# Altium schematic sheet Sheet1.SchDoc (part 1 of 2)
size A1; SheetNumber: 1; SheetTotal: 1
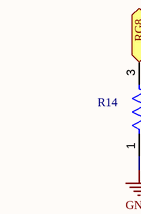
[diagram p0: Sheet1.SchDoc, top left]
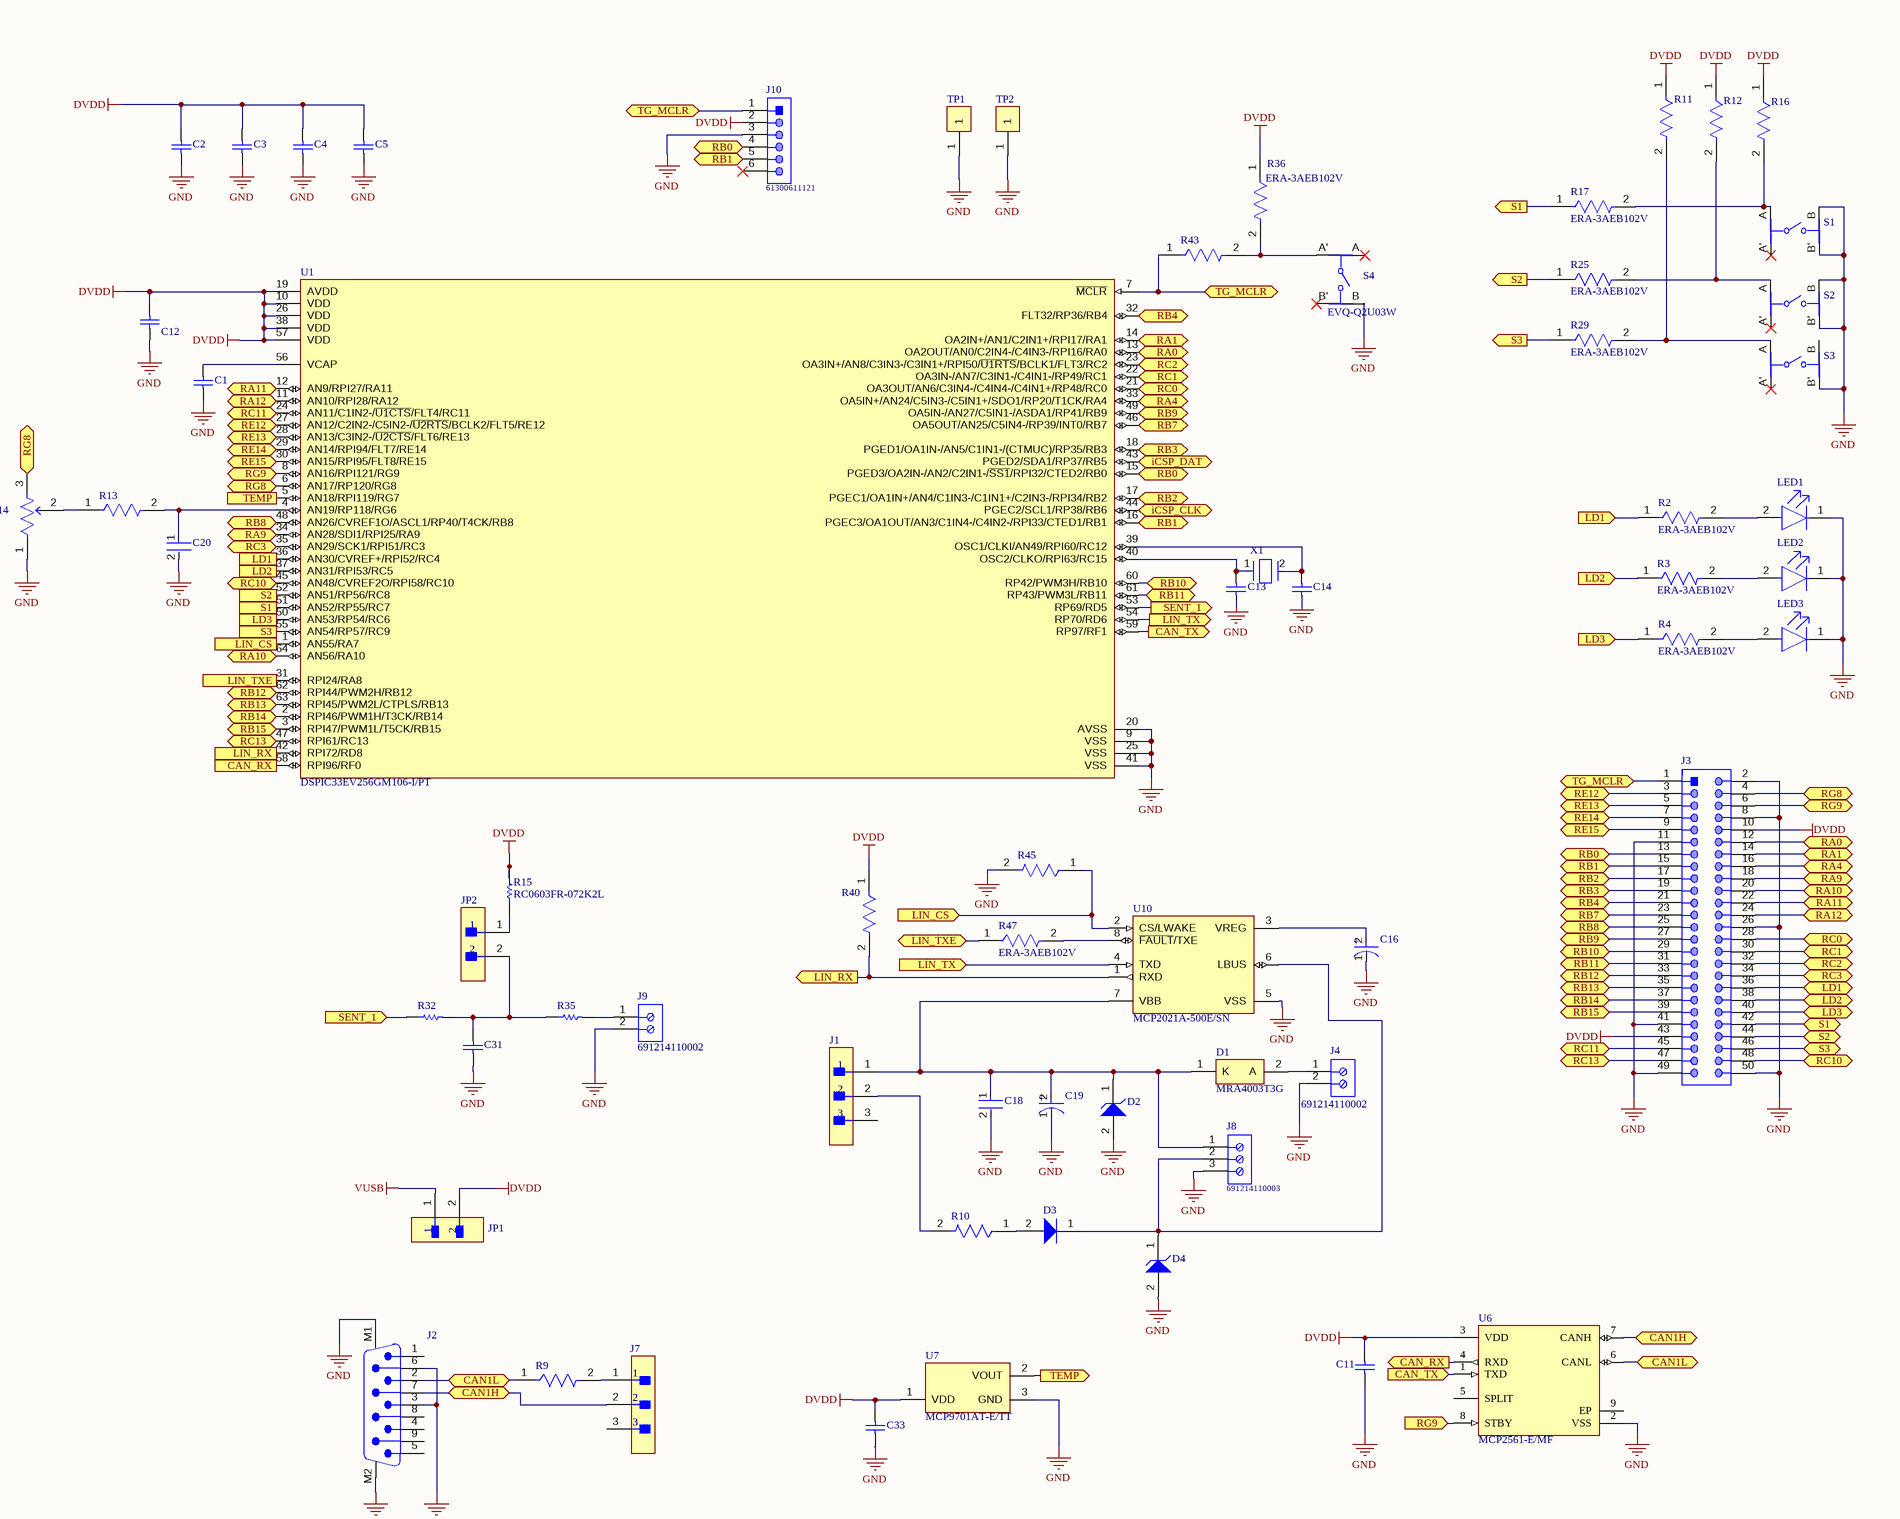
[diagram p1: Sheet1.SchDoc, top right]
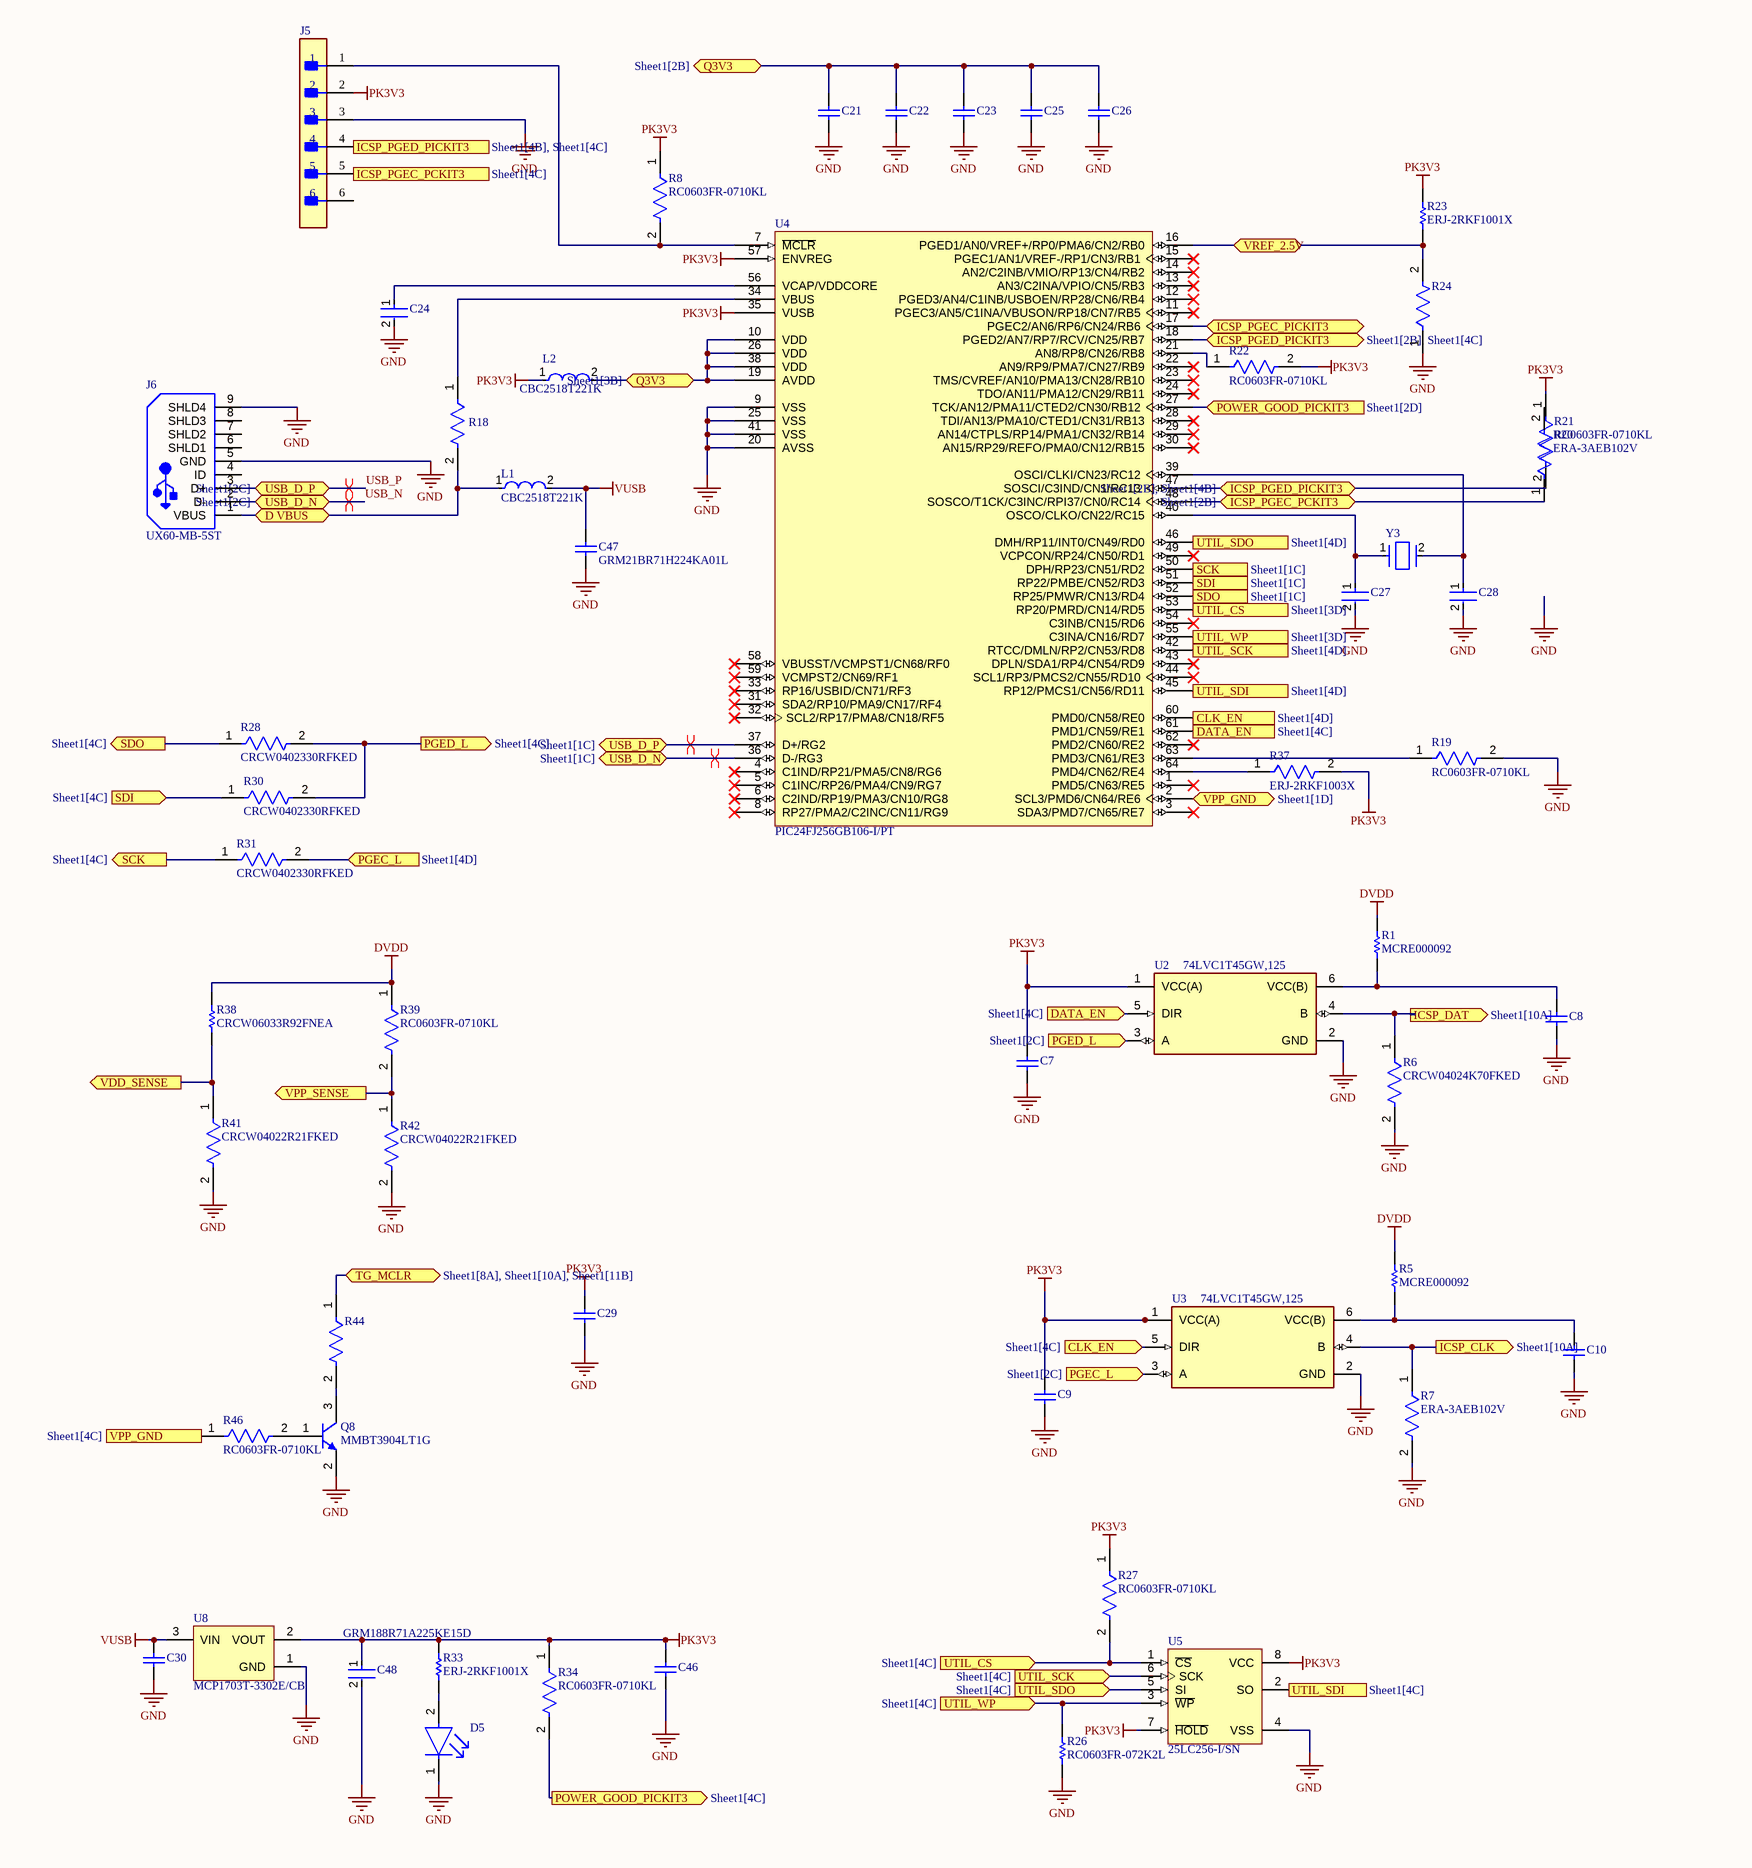
[diagram p2: Sheet1.SchDoc, bottom left]

## Parts
C1  CAP 10uF 25V 1206(3216)  [CAPC1206(3216)190_N]  (value not drawn)
C2  (no value)  [CAPC1608X90X35ML10T15]
C3  (no value)  [CAPC1608X90X35ML10T15]
C4  (no value)  [CAPC1608X90X35ML10T15]
C5  (no value)  [CAPC1608X90X35ML10T15]
C7  (no value)  [CAPC1608X90X35ML10T15]
C8  (no value)  [CAPC1608X90X35ML10T15]
C9  (no value)  [CAPC1608X90X35ML10T15]
C10  (no value)  [CAPC1608X90X35ML10T15]
C11  VJ0603Y104JXACW1BC  [CAPC1608X95X40LL15T15]  (value not drawn)
C12  CAP 220nF 50V 0805(2012)  [CAPC0805(2012)100_M]  (value not drawn)
C13  CC0603JRNPO9BN270  [CAPC1608X90X40LL10T20]  (value not drawn)
C14  CC0603JRNPO9BN270  [CAPC1608X90X40LL10T20]  (value not drawn)
C16  EEE-FK1H100P  [FP-FKD-MFG]  (value not drawn)
C18  (no value)  [FP-C0603C-CF-IPC_C]
C19  EEE-FK1H100P  [FP-FKD-MFG]  (value not drawn)
C20  CC0805KRX7R9BB222  [FP-CC0805-0_85-MFG]  (value not drawn)
C21  (no value)  [CAPC1608X90X35ML10T15]
C22  (no value)  [CAPC1608X90X35ML10T15]
C23  (no value)  [CAPC1608X90X35ML10T15]
C24  (no value)  [FP-GRM21B-0_15-MFG]
C25  (no value)  [CAPC1608X90X35ML10T15]
C26  (no value)  [CAPC1608X90X35ML10T15]
C27  (no value)  [FP-C0402-BB-MFG]
C28  (no value)  [FP-C0402-BB-MFG]
C29  (no value)  [CAPC1608X90X35ML10T15]
C30  (no value)  [CAPC1608X90X35ML10T15]
C31  GRM188R71H222KA01D  [CAPC1608X90X35NL10T15]  (value not drawn)
C33  VJ0603Y104JXACW1BC  [CAPC1608X95X40LL15T15]  (value not drawn)
C46  (no value)  [CAPC1608X90X35ML10T15]
C47  GRM21BR71H224KA01L  [CAPC2013X135X45NL10T25]
C48  GRM188R71A225KE15D  [FP-GRM188-0_1-e0_2_0_5-MFG]
D1  MRA4003T3G  [ONSC-SMA-2-403D-02_V]
D2  MMSZ43T1G  [ONSC-SOD-123-2-425-04_V]  (value not drawn)
D3  BAS21HT1G  [ONSC-SOD-323-2-477-02_V]  (value not drawn)
D4  1SMB5935BT3G  [ONSC-SMB-2-403A-03_H_V]  (value not drawn)
D5  (no value)  [FP-LTST-C190GKT-MFG]
J1  87224-3  [FP-87224-3-MFG]  (value not drawn)
J2  618009231421  [618009231421]  (value not drawn)
J3  61205021621  [61205021621]  (value not drawn)
J4  691214110002  [691214110002]
J5  (no value)  [FP-TMM-106-01-T-S-RA-MFG]
J6  UX60-MB-5ST  [HIRO-UX60-MB-5ST_V]
J7  87224-3  [FP-87224-3-MFG]  (value not drawn)
J8  691214110003  [691214110003]
J9  691214110002  [691214110002]
J10  61300611121  [61300611121]
JP1  M20-9990246  [FP-M20-9990246-MFG]  (value not drawn)
JP2  TSW-102-07-F-S  [FP-TSW-102-07-F-S-MFG]  (value not drawn)
L1  CBC2518T221K  [FP-CB2518-IPC_B]
L2  CBC2518T221K  [FP-CB2518-IPC_B]
LED1  LTST-C230KRKT  [FP-LTST-C230KRKT-MFG]  (value not drawn)
LED2  LTST-C230KRKT  [FP-LTST-C230KRKT-MFG]  (value not drawn)
LED3  LTST-C230KRKT  [FP-LTST-C230KRKT-MFG]  (value not drawn)
Q8  MMBT3904LT1G  [ONSC-SOT-23-3-318-08_V]
R1  MCRE000092  [RESC0603X26X15LL03T05]
R2  ERA-3AEB102V  [FP-ERA3A-IPC_B]
R3  ERA-3AEB102V  [FP-ERA3A-IPC_B]
R4  ERA-3AEB102V  [FP-ERA3A-IPC_B]
R5  MCRE000092  [RESC0603X26X15LL03T05]
R6  CRCW04024K70FKED  [FP-CRCW0402-e3-IPC_C]
R7  ERA-3AEB102V  [FP-ERA3A-IPC_B]
R8  RC0603FR-0710KL  [FP-RC0603-0_55-IPC_C]
R9  (no value)  [FP-CRCW0603-e3-IPC_C]
R10  (no value)  [FP-RC0603-0_55-IPC_C]
R11  (no value)  [FP-RC0603-0_55-IPC_C]
R12  (no value)  [FP-RC0603-0_55-IPC_C]
R13  (no value)  [FP-MCT0603-IPC_C]
R14  3296W-1-253LF  [FP-3296W-MFG]  (value not drawn)
R15  RC0603FR-072K2L  [RESC1608X55X25LL10T15]
R16  (no value)  [FP-RC0603-0_55-IPC_C]
R17  ERA-3AEB102V  [FP-ERA3A-IPC_B]
R18  (no value)  [FP-ERJ2RK-IPC_C]
R19  RC0603FR-0710KL  [FP-RC0603-0_55-IPC_C]
R20  ERA-3AEB102V  [FP-ERA3A-IPC_B]
R21  RC0603FR-0710KL  [FP-RC0603-0_55-IPC_C]
R22  RC0603FR-0710KL  [FP-RC0603-0_55-IPC_C]
R23  ERJ-2RKF1001X  [RESC1005X40X25NL05T05]
R24  (no value)  [FP-CRCW0603-e3-IPC_C]
R25  ERA-3AEB102V  [FP-ERA3A-IPC_B]
R26  RC0603FR-072K2L  [RESC1608X55X25LL10T15]
R27  RC0603FR-0710KL  [FP-RC0603-0_55-IPC_C]
R28  CRCW0402330RFKED  [FP-CRCW0402-e3-IPC_C]
R29  ERA-3AEB102V  [FP-ERA3A-IPC_B]
R30  CRCW0402330RFKED  [FP-CRCW0402-e3-IPC_C]
R31  CRCW0402330RFKED  [FP-CRCW0402-e3-IPC_C]
R32  RC0603FR-0747RL  [RESC1608X55X25ML10T15]  (value not drawn)
R33  ERJ-2RKF1001X  [RESC1005X40X25NL05T05]
R34  RC0603FR-0710KL  [FP-RC0603-0_55-IPC_C]
R35  RC0603FR-0747RL  [RESC1608X55X25ML10T15]  (value not drawn)
R36  ERA-3AEB102V  [FP-ERA3A-IPC_B]
R37  ERJ-2RKF1003X  [FP-ERJ2RK-IPC_C]
R38  CRCW06033R92FNEA  [RESC1609X50X30LL10T20]
R39  RC0603FR-0710KL  [FP-RC0603-0_55-IPC_C]
R40  (no value)  [FP-RC0603-0_55-IPC_C]
R41  CRCW04022R21FKED  [FP-CRCW0402-e3-IPC_C]
R42  CRCW04022R21FKED  [FP-CRCW0402-e3-IPC_C]
R43  (no value)  [FP-MCT0603-IPC_C]
R44  (no value)  [FP-MCT0603-IPC_C]
R45  (no value)  [FP-RC0603-0_55-IPC_C]
R46  RC0603FR-0710KL  [FP-RC0603-0_55-IPC_C]
R47  ERA-3AEB102V  [FP-ERA3A-IPC_B]
S1  (no value)  [FP-EVQQ2-MFG]
S2  (no value)  [FP-EVQQ2-MFG]
S3  (no value)  [FP-EVQQ2-MFG]
S4  EVQ-Q2U03W  [FP-EVQQ2-MFG]
TP1  5001  [FP-5001-MFG]  (value not drawn)
TP2  5001  [FP-5001-MFG]  (value not drawn)
U1  DSPIC33EV256GM106-I/PT  [FP-C04-085-IPC_B]
U2  74LVC1T45GW,125  [FP-SOT363-IPC_C]
U3  74LVC1T45GW,125  [FP-SOT363-IPC_C]
U4  PIC24FJ256GB106-I/PT  [TQFP-PT64_L]
U5  25LC256-I/SN  [SOIC-SN8_L]
U6  MCP2561-E/MF  [FP-C04-062-MFG]
U7  MCP9701AT-E/TT  [SOT-23-TT3_M]
U8  MCP1703T-3302E/CB  [SOT-23A-CB3_L]
U10  MCP2021A-500E/SN  [MCHP-SOIC-SN8_N]
X1  ABLS2-8.000MHZ-D4Y-T  [FP-ABLS2-MFG]  (value not drawn)
Y3  (no value)  [FP-ABM7-MFG]

## Ports
CAN1H (bidir, see Sheet1[8C]), CAN1H (bidir, see Sheet1[11C]), CAN1L (bidir, see Sheet1[8C]), CAN1L (bidir, see Sheet1[11C]), CAN_RX (in, see Sheet1[11C]), CAN_RX (out, see Sheet1[7B]), CAN_TX (in, see Sheet1[10B]), CAN_TX (out, see Sheet1[11C]), CLK_EN (in, see Sheet1[4C]), CLK_EN (out, see Sheet1[4D]), D VBUS (bidir), DATA_EN (in, see Sheet1[4C]), DATA_EN (out, see Sheet1[4C]), iCSP_CLK (bidir, see Sheet1[5D]), ICSP_CLK (out, see Sheet1[10A]), iCSP_DAT (bidir, see Sheet1[5C]), ICSP_DAT (out, see Sheet1[10A]), ICSP_PGEC_PCKIT3 (bidir, see Sheet1[2B]), ICSP_PGEC_PCKIT3 (out, see Sheet1[4C]), ICSP_PGEC_PICKIT3 (bidir), ICSP_PGED_PICKIT3 (bidir, see Sheet1[2B], Sheet1[4B]), ICSP_PGED_PICKIT3 (bidir, see Sheet1[2B], Sheet1[4C]), ICSP_PGED_PICKIT3 (out, see Sheet1[4B], Sheet1[4C]), LD1 (bidir, see Sheet1[7A], Sheet1[11A]), LD1 (in, see Sheet1[7A], Sheet1[12B]), LD1 (out, see Sheet1[11A], Sheet1[12B]), LD2 (bidir, see Sheet1[7A], Sheet1[11A]), LD2 (in, see Sheet1[7A], Sheet1[12B]), LD2 (out, see Sheet1[11A], Sheet1[12B]), LD3 (bidir, see Sheet1[7A], Sheet1[11B]), LD3 (in, see Sheet1[7A], Sheet1[12B]), LD3 (out, see Sheet1[11B], Sheet1[12B]), LIN_CS (in, see Sheet1[7B]), LIN_CS (out, see Sheet1[9B]), LIN_RX (in, see Sheet1[9B]), LIN_RX (out), LIN_TX (in, see Sheet1[10A]), LIN_TX (out, see Sheet1[9B]), LIN_TXE (bidir, see Sheet1[7B]), LIN_TXE (out, see Sheet1[9B]), PGEC_L (in, see Sheet1[2C]), PGEC_L (in, see Sheet1[4D]), PGED_L (in, see Sheet1[2C]), PGED_L (out, see Sheet1[4C]), POWER_GOOD_PICKIT3 (in, see Sheet1[2D]), POWER_GOOD_PICKIT3 (out, see Sheet1[4C]), Q3V3 (bidir, see Sheet1[2B]), Q3V3 (bidir, see Sheet1[3B]), RA0 (bidir, see Sheet1[10A]), RA0 (bidir, see Sheet1[12B]), RA1 (bidir, see Sheet1[10A]), RA1 (bidir, see Sheet1[12B]), RA4 (bidir, see Sheet1[10A]), RA4 (bidir, see Sheet1[12B]), RA9 (bidir, see Sheet1[7A]), RA9 (bidir, see Sheet1[12B]), RA10 (bidir, see Sheet1[7B]), RA10 (bidir, see Sheet1[12B]), RA11 (bidir, see Sheet1[7A]), RA11 (bidir, see Sheet1[12B]), RA12 (bidir, see Sheet1[7A]), RA12 (bidir, see Sheet1[12B]), RB0 (bidir, see Sheet1[8A], Sheet1[10A]), RB0 (bidir, see Sheet1[8A], Sheet1[11B]), RB0 (bidir, see Sheet1[10A], Sheet1[11B]), RB1 (bidir, see Sheet1[8A], Sheet1[10A]), RB1 (bidir, see Sheet1[8A], Sheet1[11B]), RB1 (bidir, see Sheet1[10A], Sheet1[11B]), RB2 (bidir, see Sheet1[10A]), RB2 (bidir, see Sheet1[11B]), RB3 (bidir, see Sheet1[10A]), RB3 (bidir, see Sheet1[11B]), RB4 (bidir, see Sheet1[10A]), RB4 (bidir, see Sheet1[11B]), RB7 (bidir, see Sheet1[10A]), RB7 (bidir, see Sheet1[11B]), RB8 (bidir, see Sheet1[7A]), RB8 (bidir, see Sheet1[11B]), RB9 (bidir, see Sheet1[10A]), RB9 (bidir, see Sheet1[11B]), RB10 (bidir, see Sheet1[10A]), RB10 (bidir, see Sheet1[11B]), RB11 (bidir, see Sheet1[10A]), RB11 (bidir, see Sheet1[11B]), RB12 (bidir, see Sheet1[7B]), RB12 (bidir, see Sheet1[11B]), RB13 (bidir, see Sheet1[7B]), RB13 (bidir, see Sheet1[11B]), RB14 (bidir, see Sheet1[7B]), RB14 (bidir, see Sheet1[11B]), RB15 (bidir, see Sheet1[7B]), RB15 (bidir, see Sheet1[11B]), RC0 (bidir, see Sheet1[10A]), RC0 (bidir, see Sheet1[12B]), RC1 (bidir, see Sheet1[10A]), RC1 (bidir, see Sheet1[12B]), RC2 (bidir, see Sheet1[10A]), RC2 (bidir, see Sheet1[12B]), RC3 (bidir, see Sheet1[7A]), RC3 (bidir, see Sheet1[12B]), RC10 (bidir, see Sheet1[7A]), RC10 (bidir, see Sheet1[12B]), RC11 (bidir, see Sheet1[7A]), RC11 (bidir, see Sheet1[11B]), RC13 (bidir, see Sheet1[7B]), RC13 (bidir, see Sheet1[11B]), RE12 (bidir, see Sheet1[7A]), RE12 (bidir, see Sheet1[11B]), RE13 (bidir, see Sheet1[7A]), RE13 (bidir, see Sheet1[11B]), RE14 (bidir, see Sheet1[7A]), RE14 (bidir, see Sheet1[11B]), RE15 (bidir, see Sheet1[7A]), RE15 (bidir, see Sheet1[11B]), RG8 (bidir, see Sheet1[6A], Sheet1[7A]), RG8 (bidir, see Sheet1[6A], Sheet1[12B]), RG8 (bidir, see Sheet1[7A], Sheet1[12B]), RG9 (bidir, see Sheet1[7A], Sheet1[11C]), RG9 (bidir, see Sheet1[11C], Sheet1[12B]), RG9 (in, see Sheet1[7A], Sheet1[12B]), S1 (bidir, see Sheet1[7A], Sheet1[11A]), S1 (in, see Sheet1[11A], Sheet1[12B]), S1 (out, see Sheet1[7A], Sheet1[12B]), S2 (bidir, see Sheet1[7A], Sheet1[11A]), S2 (in, see Sheet1[11A], Sheet1[12B]), S2 (out, see Sheet1[7A], Sheet1[12B]), S3 (bidir, see Sheet1[7B], Sheet1[11A]), S3 (in, see Sheet1[11A], Sheet1[12B]), S3 (out, see Sheet1[7B], Sheet1[12B]), SCK (out, see Sheet1[1C]), SCK (out, see Sheet1[4C]), SDI (in, see Sheet1[1C]), SDI (in, see Sheet1[4C]), SDO (out, see Sheet1[1C]), SDO (out, see Sheet1[4C]), SENT_1 (in, see Sheet1[10A]), SENT_1 (out, see Sheet1[7B]), TEMP (in, see Sheet1[9C]), TEMP (out, see Sheet1[7A]), TG_MCLR (bidir, see Sheet1[2D], Sheet1[8A], Sheet1[10A]), TG_MCLR (bidir, see Sheet1[2D], Sheet1[8A], Sheet1[11B]), TG_MCLR (bidir, see Sheet1[2D], Sheet1[10A], Sheet1[11B]), TG_MCLR (bidir, see Sheet1[8A], Sheet1[10A], Sheet1[11B]), USB_D_N (bidir, see Sheet1[1C]), USB_D_N (bidir, see Sheet1[2C]), USB_D_P (bidir, see Sheet1[1C]), USB_D_P (bidir, see Sheet1[2C]), UTIL_CS (in, see Sheet1[4C]), UTIL_CS (out, see Sheet1[3D]), UTIL_SCK (in, see Sheet1[4C]), UTIL_SCK (out, see Sheet1[4D]), UTIL_SDI (in, see Sheet1[4D]), UTIL_SDI (out, see Sheet1[4C]), UTIL_SDO (in, see Sheet1[4C]), UTIL_SDO (out, see Sheet1[4D]), UTIL_WP (in, see Sheet1[4C]), UTIL_WP (out, see Sheet1[3D]), VDD_SENSE (out), VPP_GND (bidir, see Sheet1[1D]), VPP_GND (in, see Sheet1[4C]), VPP_SENSE (out), VREF_2.5V (bidir)

## Nets
DVDD: C2.1 C3.1 C4.1 C5.1 C11.2 C12.2 C33.2 J3.10(DVDD) J3.43(DVDD) J10.2 JP1.2 R1.2 R5.2 R11.1 R12.1 R15.2 R16.1 R36.1 R38.2 R39.1 R40.1 U1.10(VDD) U1.19(AVDD) U1.26(VDD) U1.38(VDD) U1.57(VDD) U6.3(VDD) U7.1(VDD)
GND: C1.1 C2.2 C3.2 C4.2 C5.2 C7.2 C8.2 C9.2 C10.2 C11.1 C12.1 C13.1 C14.1 C16.1(C) C18.2 C19.1(C) C20.2 C21.2 C22.2 C23.2 C24.2 C25.2 C26.2 C27.2 C28.2 C29.2 C30.2 C31.1 C33.1 C46.2 C47.2 C48.2 D2.2(A) D4.2(A) D5.1(C) J2.3 J2.6 J2.M1 J2.M2 J3.2(GND) J3.8(GND) J3.11(GND) J3.26(GND) J3.41(GND) J3.49(GND) J3.50(GND) J4.2 J5.3 J6.5(GND) J6.9(SHLD4) J8.3 J9.2 J10.3 LED1.1(C) LED2.1(C) LED3.1(C) Q8.2(E) R6.2 R7.2 R14.1(CCW) R19.2 R24.1 R26.1 R41.2 R42.2 R45.2 S1.B S1.B' S2.B S2.B' S3.B' S4.B TP1.1 TP2.1 U1.9(VSS) U1.20(AVSS) U1.25(VSS) U1.41(VSS) U2.2(GND) U3.2(GND) U4.9(VSS) U4.20(AVSS) U4.25(VSS) U4.41(VSS) U5.4(VSS) U6.2(VSS) U7.3(GND) U8.1(GND) U10.5(VSS)
PK3V3: C7.1 C9.1 C29.1 C46.1 C48.1 J5.2 L2.1 R8.1 R21.1 R22.2 R23.1 R27.1 R33.1 R34.1 R37.2 U2.1(VCC(A)) U3.1(VCC(A)) U4.35(VUSB) U4.57(ENVREG) U5.7(~{HOLD}) U5.8(VCC) U8.2(VOUT)
VUSB: C30.1 C47.1 JP1.1 L1.2 U8.3(VIN)
CAN1H: J2.7 J7.2 U6.7(CANH) ; port CAN1H
CAN1L: J2.2 R9.1 U6.6(CANL) ; port CAN1L
CAN_RX: U1.58(RPI96/RF0) U6.4(RXD) ; port CAN_RX
CAN_TX: U1.59(RP97/RF1) U6.1(TXD) ; port CAN_TX
CLK_EN: U3.5(DIR) U4.60(PMD0/CN58/RE0) ; port CLK_EN
D VBUS: J6.1(VBUS) L1.1 R18.2 ; port D VBUS
DATA_EN: U2.5(DIR) U4.61(PMD1/CN59/RE1) ; port DATA_EN
ICSP_CLK: R7.1 U1.44(PGEC2/SCL1/RP38/RB6) U3.4(B) ; port ICSP_CLK, port iCSP_CLK
ICSP_DAT: R6.1 U1.43(PGED2/SDA1/RP37/RB5) U2.4(B) ; port ICSP_DAT, port iCSP_DAT
ICSP_PGEC_PCKIT3: J5.5 R20.1 U4.48(SOSCO/T1CK/C3INC/RPI37/CN0/RC14) ; port ICSP_PGEC_PCKIT3
ICSP_PGEC_PICKIT3: U4.17(PGEC2/AN6/RP6/CN24/RB6) ; port ICSP_PGEC_PICKIT3
ICSP_PGED_PICKIT3: J5.4 R21.2 U4.18(PGED2/AN7/RP7/RCV/CN25/RB7) U4.47(SOSCI/C3IND/CN1/RC13) ; port ICSP_PGED_PICKIT3
LD1: J3.36(RC4) R2.1 U1.36(AN30/CVREF+/RPI52/RC4) ; port LD1
LD2: J3.38(RC5) R3.1 U1.37(AN31/RPI53/RC5) ; port LD2
LD3: J3.40(RC6) R4.1 U1.50(AN53/RP54/RC6) ; port LD3
LIN_CS: R45.1 U1.1(AN55/RA7) U10.2(CS/LWAKE) ; port LIN_CS
LIN_RX: R40.2 U1.42(RPI72/RD8) U10.1(RXD) ; port LIN_RX
LIN_TX: U1.54(RP70/RD6) U10.4(TXD) ; port LIN_TX
LIN_TXE: R47.1 U1.31(RPI24/RA8) ; port LIN_TXE
PGEC_L: R31.2 U3.3(A) ; port PGEC_L
PGED_L: R28.2 R30.2 U2.3(A) ; port PGED_L
POWER_GOOD_PICKIT3: R34.2 U4.27(TCK/AN12/PMA11/CTED2/CN30/RB12) ; port POWER_GOOD_PICKIT3
Q3V3: C21.1 C22.1 C23.1 C25.1 C26.1 L2.2 U4.10(VDD) U4.19(AVDD) U4.26(VDD) U4.38(VDD) ; port Q3V3
RA0: J3.12(RA0) U1.13(OA2OUT/AN0/C2IN4-/C4IN3-/RPI16/RA0) ; port RA0
RA1: J3.14(RA1) U1.14(OA2IN+/AN1/C2IN1+/RPI17/RA1) ; port RA1
RA4: J3.16(RA4) U1.33(OA5IN+/AN24/C5IN3-/C5IN1+/SDO1/RP20/T1CK/RA4) ; port RA4
RA9: J3.18(RA9) U1.34(AN28/SDI1/RPI25/RA9) ; port RA9
RA10: J3.20(RA10) U1.64(AN56/RA10) ; port RA10
RA11: J3.22(RA11) U1.12(AN9/RPI27/RA11) ; port RA11
RA12: J3.24(RA12) U1.11(AN10/RPI28/RA12) ; port RA12
RB0: J3.13(RB0) J10.4 U1.15(PGED3/OA2IN-/AN2/C2IN1-/~{SS1}/RPI32/CTED2/RB0) ; port RB0
RB1: J3.15(RB1) J10.5 U1.16(PGEC3/OA1OUT/AN3/C1IN4-/C4IN2-/RPI33/CTED1/RB1) ; port RB1
RB2: J3.17(RB2) U1.17(PGEC1/OA1IN+/AN4/C1IN3-/C1IN1+/C2IN3-/RPI34/RB2) ; port RB2
RB3: J3.19(RB3) U1.18(PGED1/OA1IN-/AN5/C1IN1-/(CTMUC)/RP35/RB3) ; port RB3
RB4: J3.21(RB4) U1.32(FLT32/RP36/RB4) ; port RB4
RB7: J3.23(RB7) U1.46(OA5OUT/AN25/C5IN4-/RP39/INT0/RB7) ; port RB7
RB8: J3.25(RB8) U1.48(AN26/CVREF1O/ASCL1/RP40/T4CK/RB8) ; port RB8
RB9: J3.27(RB9) U1.49(OA5IN-/AN27/C5IN1-/ASDA1/RP41/RB9) ; port RB9
RB10: J3.29(RB10) U1.60(RP42/PWM3H/RB10) ; port RB10
RB11: J3.31(RB11) U1.61(RP43/PWM3L/RB11) ; port RB11
RB12: J3.33(RB12) U1.62(RPI44/PWM2H/RB12) ; port RB12
RB13: J3.35(RB13) U1.63(RPI45/PWM2L/CTPLS/RB13) ; port RB13
RB14: J3.37(RB14) U1.2(RPI46/PWM1H/T3CK/RB14) ; port RB14
RB15: J3.39(RB15) U1.3(RPI47/PWM1L/T5CK/RB15) ; port RB15
RC0: J3.28(RC0) U1.21(OA3OUT/AN6/C3IN4-/C4IN4-/C4IN1+/RP48/RC0) ; port RC0
RC1: J3.30(RC1) U1.22(OA3IN-/AN7/C3IN1-/C4IN1-/RP49/RC1) ; port RC1
RC2: J3.32(RC2) U1.23(OA3IN+/AN8/C3IN3-/C3IN1+/RPI50/~{U1RTS}/BCLK1/FLT3/RC2) ; port RC2
RC3: J3.34(RC3) U1.35(AN29/SCK1/RPI51/RC3) ; port RC3
RC10: J3.48(RC10) U1.45(AN48/CVREF2O/RPI58/RC10) ; port RC10
RC11: J3.45(RC11) U1.24(AN11/C1IN2-/~{U1CTS}/FLT4/RC11) ; port RC11
RC13: J3.47(RC13) U1.47(RPI61/RC13) ; port RC13
RE12: J3.3(RE12) U1.27(AN12/C2IN2-/C5IN2-/~{U2RTS}/BCLK2/FLT5/RE12) ; port RE12
RE13: J3.5(RE13) U1.28(AN13/C3IN2-/~{U2CTS}/FLT6/RE13) ; port RE13
RE14: J3.7(RE14) U1.29(AN14/RPI94/FLT7/RE14) ; port RE14
RE15: J3.9(RE15) U1.30(AN15/RPI95/FLT8/RE15) ; port RE15
RG8: J3.4(RG8) R14.3(CW) U1.6(AN17/RP120/RG8) ; port RG8
RG9: J3.6(RG9) U1.8(AN16/RPI121/RG9) U6.8(STBY) ; port RG9
S1: J3.42(RC7) R17.1 U1.51(AN52/RP55/RC7) ; port S1
S2: J3.44(RC8) R25.1 U1.52(AN51/RP56/RC8) ; port S2
S3: J3.46(RC9) R29.1 U1.55(AN54/RP57/RC9) ; port S3
SCK: R31.1 U4.50(DPH/RP23/CN51/RD2) ; port SCK
SDI: R30.1 U4.51(RP22/PMBE/CN52/RD3) ; port SDI
SDO: R28.1 U4.52(RP25/PMWR/CN13/RD4) ; port SDO
SENT_1: R32.1 U1.53(RP69/RD5) ; port SENT_1
TEMP: U1.5(AN18/RPI119/RG7) U7.2(VOUT) ; port TEMP
TG_MCLR: J3.1(MCLR) J10.1 R43.1 R44.1 U1.7(~{MCLR}) ; port TG_MCLR
USB_N: J6.2(D-) U4.36(D-/RG3) ; port USB_D_N
USB_P: J6.3(D+) U4.37(D+/RG2) ; port USB_D_P
UTIL_CS: R27.2 U4.53(RP20/PMRD/CN14/RD5) U5.1(~{CS}) ; port UTIL_CS
UTIL_SCK: U4.42(RTCC/DMLN/RP2/CN53/RD8) U5.6(SCK) ; port UTIL_SCK
UTIL_SDI: U4.45(RP12/PMCS1/CN56/RD11) U5.2(SO) ; port UTIL_SDI
UTIL_SDO: U4.46(DMH/RP11/INT0/CN49/RD0) U5.5(SI) ; port UTIL_SDO
UTIL_WP: R26.2 U4.55(C3INA/CN16/RD7) U5.3(~{WP}) ; port UTIL_WP
VDD_SENSE: R38.1 R41.1 ; port VDD_SENSE
VPP_GND: R46.1 U4.2(SCL3/PMD6/CN64/RE6) ; port VPP_GND
VPP_SENSE: R39.2 R42.1 ; port VPP_SENSE
VREF_2.5V: R23.2 R24.2 U4.16(PGED1/AN0/VREF+/RP0/PMA6/CN2/RB0) ; port VREF_2.5V
NetC1_2: C1.2 U1.56(VCAP)
NetC8_1: C8.1 R1.1 U2.6(VCC(B))
NetC10_1: C10.1 R5.1 U3.6(VCC(B))
NetC13_2: C13.2 U1.40(OSC2/CLKO/RPI63/RC15) X1.1
NetC14_2: C14.2 U1.39(OSC1/CLKI/AN49/RPI60/RC12) X1.2
NetC16_2: C16.2(A) U10.3(VREG)
NetC18_1: C18.1 C19.2(A) D1.1(K) D2.1(K) J1.1 J8.1 U10.7(VBB)
NetC20_1: C20.1 R13.2 U1.4(AN19/RP118/RG6)
NetC24_1: C24.1 U4.56(VCAP/VDDCORE)
NetC27_1: C27.1 U4.40(OSCO/CLKO/CN22/RC15) Y3.1
NetC28_1: C28.1 U4.39(OSCI/CLKI/CN23/RC12) Y3.2
NetC31_2: C31.2 JP2.2 R32.2 R35.1
NetD1_2: D1.2(A) J4.1
NetD3_1: D3.1(K) D4.1(K) J8.2 U10.6(LBUS)
NetD3_2: D3.2(A) R10.1
NetD5_2: D5.2(A) R33.2
NetJ1_2: J1.2 R10.2
NetJ5_1: J5.1 R8.2 U4.7(~{MCLR})
NetJ7_1: J7.1 R9.2
NetJ9_1: J9.1 R35.2
NetJP2_1: JP2.1 R15.1
NetLED1_2: LED1.2(A) R2.2
NetLED2_2: LED2.2(A) R3.2
NetLED3_2: LED3.2(A) R4.2
NetQ8_1: Q8.1(B) R46.2
NetQ8_3: Q8.3(C) R44.2
NetR11_2: R11.2 R29.2 S3.A
NetR12_2: R12.2 R25.2 S2.A
NetR13_1: R13.1 R14.2(WIPER)
NetR16_2: R16.2 R17.2 S1.A
NetR18_1: R18.1 U4.34(VBUS)
NetR19_1: R19.1 U4.63(PMD3/CN61/RE3)
NetR22_1: R22.1 U4.21(AN8/RP8/CN26/RB8)
NetR36_2: R36.2 R43.2 S4.A'
NetR37_1: R37.1 U4.64(PMD4/CN62/RE4)
NetR47_2: R47.2 U10.8(~{FAULT}/TXE)

Not connected (* = marked no-connect by the designer): J1 3; J2 1 4 5 8 9; J5 6; J6 4(ID) 6(SHLD1) 7(SHLD2) 8(SHLD3); J7 3; J10 6*; R20 2; S1 A'*; S2 A'*; S3 A'* B; S4 A* B'*; U4 1(PMD5/CN63/RE5)* 3(SDA3/PMD7/CN65/RE7)* 4(C1IND/RP21/PMA5/CN8/RG6)* 5(C1INC/RP26/PMA4/CN9/RG7)* 6(C2IND/RP19/PMA3/CN10/RG8)* 8(RP27/PMA2/C2INC/CN11/RG9)* 11(PGEC3/AN5/C1INA/VBUSON/RP18/CN7/RB5)* 12(PGED3/AN4/C1INB/USBOEN/RP28/CN6/RB4)* 13(AN3/C2INA/VPIO/CN5/RB3)* 14(AN2/C2INB/VMIO/RP13/CN4/RB2)* 15(PGEC1/AN1/VREF-/RP1/CN3/RB1)* 22(AN9/RP9/PMA7/CN27/RB9)* 23(TMS/CVREF/AN10/PMA13/CN28/RB10)* 24(TDO/AN11/PMA12/CN29/RB11)* 28(TDI/AN13/PMA10/CTED1/CN31/RB13)* 29(AN14/CTPLS/RP14/PMA1/CN32/RB14)* 30(AN15/RP29/REFO/PMA0/CN12/RB15)* 31(SDA2/RP10/PMA9/CN17/RF4)* 32(SCL2/RP17/PMA8/CN18/RF5)* 33(RP16/USBID/CN71/RF3)* 43(DPLN/SDA1/RP4/CN54/RD9)* 44(SCL1/RP3/PMCS2/CN55/RD10)* 49(VCPCON/RP24/CN50/RD1)* 54(C3INB/CN15/RD6)* 58(VBUSST/VCMPST1/CN68/RF0)* 59(VCMPST2/CN69/RF1)* 62(PMD2/CN60/RE2)*; U6 5(SPLIT) 9(EP)

## Layout directives
differential pair: USB_N, USB_P

## Notes on the sheet
- DWG NO:
- REV:
- THIS DOCUMENT AND THE DATA DISCLOSED HEREIN OR
- HEREWITH IS THE PROPERTY OF ALTIUM LIMITED AND MAY
- BE FREELY DISTRIBUTED IN WHOLE. NO RIGHTS ARE
- RESERVED OR EXPRESS OR IMPLIED WARANTEE GIVEN.
- REVISION
- DESCRIPTION
- DATE
- APPROVED
- ENG:
- APPROVALS
- PROJECT
- DSN:
- CHK:
- REFERENCE DOCUMENTS
- PROJECT REVISION:
- TITLE
- DOCUMENT REVISION:
- DESIGN ITEM:
- BOM:
- FAB DWG:
- PCB DWG:
- ASSY DWG:
- SCALE:
- A2
- SIZE
- CAGE CODE
- FILE NAME
- DWG NO.
- SHEET
- OF
- REV
- (in symbol CMP-2000-06207-2) +